# Altium schematic sheet bangtai.SchDoc
size A
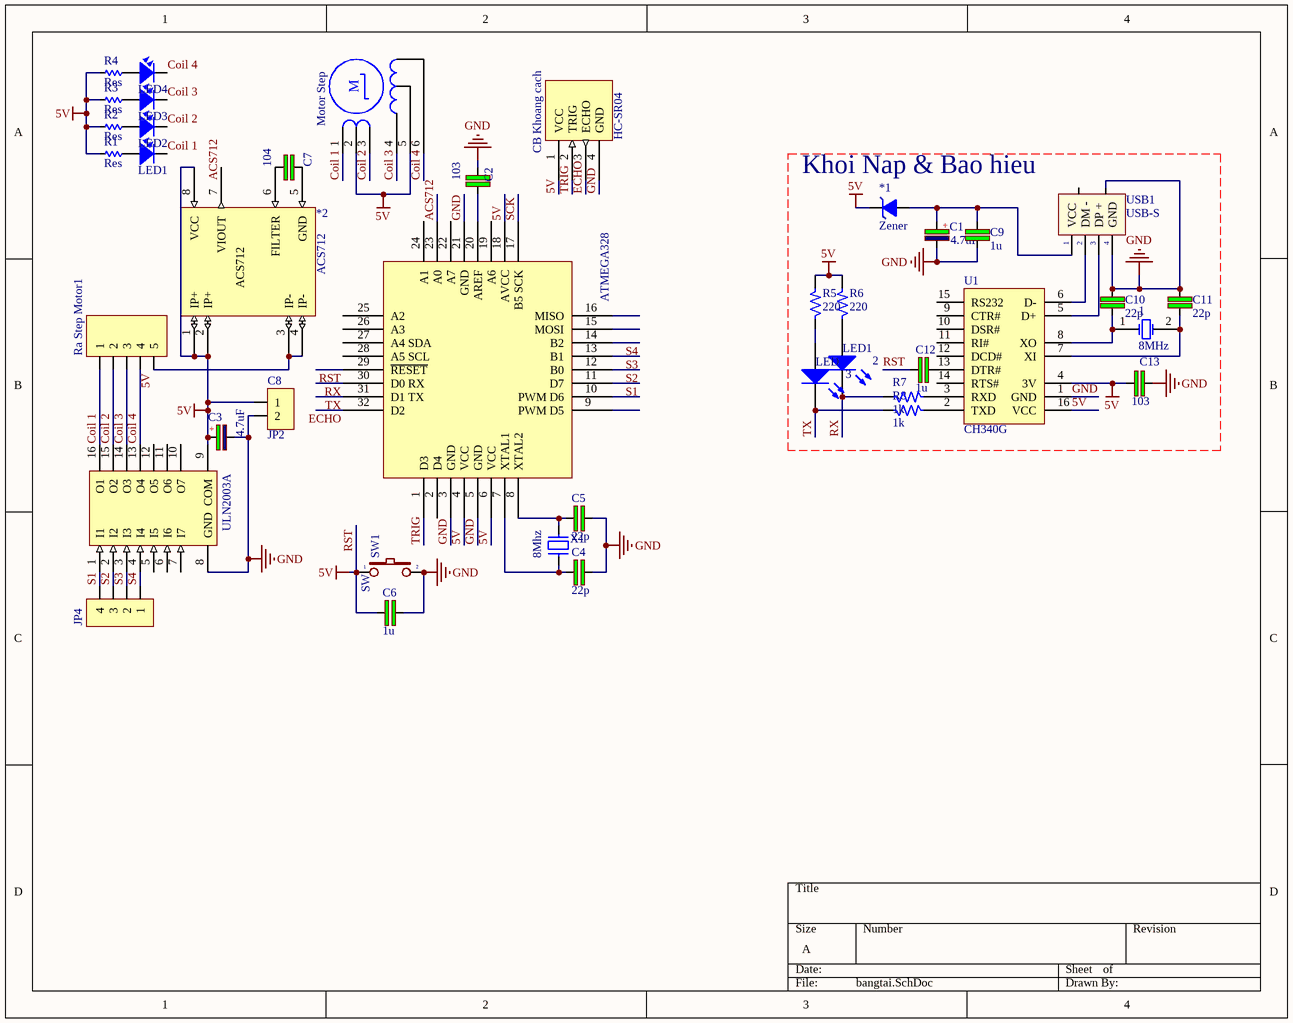
[diagram p0: bangtai.SchDoc]

## Parts
(Parts that share a designator on the sheet are numbered #1, #2 ... from top to bottom, then left to right.)
1  8MHz  [R38]
2  LED1  [3.5X2.8X1.9]
3  LED  [3.5X2.8X1.9]
*1  Zener  [D1A]
*2  ACS712  [SOIC8]
?#1  Motor Step  [HDR6]
?#2  ATMEGA328  [TQFP80P900X900X120-32N]
?#3  ULN2003A  [SO-G16/X.6]
?#4  JP4  [JP4-C1T]
C1  4.7uF  [CP4.5/19]
C2  103  [C-0805]
C3  4.7uF  [10uF/10V]
C4  22p  [C-0805]
C5  22p  [C-0805]
C6  1u  [CN1.5]
C7  104  [CN1.5]
C8  JP2  [JP2-C1T]
C9  1u  [CN3]
C10  22p  [CN3]
C11  22p  [CN3]
C12  1u  [CN3]
C13  103  [CN3]
CB_Khoang_cach  HC-SR04  [HC-SR04]
LED1  LED  [LED-3MM-YELLOW]  (value not drawn)
LED2  LED  [LED-3MM-YELLOW]  (value not drawn)
LED3  LED  [LED-3MM-YELLOW]  (value not drawn)
LED4  LED  [LED-3MM-YELLOW]  (value not drawn)
R1  Res  [RES-1/2W]
R2  Res  [RES-1/2W]
R3  Res  [RES-1/2W]
R4  Res  [RES-1/2W]
R5  220  [SM-1206]
R6  220  [SM-1206]
R7  1k  [SM-1206]
R8  1k  [SM-1206]
Ra_Step_Motor1  (no value)  [JP5-C1T]
SW1  SW  [BUTTON 2PIN TRON]
U1  CH340G  [SO16]
USB1  USB-S  [USB-S1]
X1  8Mhz  [XT2]

## Nets
5V: *1.2(K) *2.1(IP+) *2.2(IP+) *2.8(VCC) ?#1.2 ?#1.5 ?#2.4(VCC) ?#2.6(VCC) ?#2.18(AVCC) ?#2.29(~{RESET}) ?#3.9(COM) C3.1 C6.2 C8.1 C12.2 C13.1 CB_Khoang_cach.1(VCC) R1.1 R2.1 R3.1 R4.1 R5.2 R6.2 SW1.1 U1.4(3V) U1.16(VCC)  [also labelled RST]
GND: ?#2.3(GND) ?#2.5(GND) ?#2.21(GND) ?#3.8(GND) C1.2 C2.1 C3.2 C4.1 C5.1 C6.1 C8.2 C9.1 C10.2 C11.2 C13.2 CB_Khoang_cach.4(GND) SW1.2 U1.1(GND) USB1.4(GND) USB1.6
ACS712: ?#2.23(A0)
Coil 1: ?#1.1(1A) ?#3.16(O1) LED1.2 Ra_Step_Motor1.1
Coil 2: ?#1.3 ?#3.15(O2) LED2.2 Ra_Step_Motor1.2
Coil 3: ?#1.4 ?#3.14(O3) LED3.2 Ra_Step_Motor1.3
Coil 4: ?#1.6 ?#3.13(O4) LED4.2 Ra_Step_Motor1.4
ECHO: ?#2.32(D2) CB_Khoang_cach.3(ECHO)
RX: 2.2(K) ?#2.30(D0_RX) R7.1
S1: ?#2.11(D7) ?#3.1(I1) ?#4.4
S2: ?#2.12(B0) ?#3.2(I2) ?#4.3
S3: ?#2.13(B1) ?#3.3(I3) ?#4.2
S4: ?#2.14(B2) ?#3.4(I4) ?#4.1
SCK: ?#2.17(B5_SCK)
TRIG: ?#2.1(D3) CB_Khoang_cach.2(TRIG)
TX: 3.2(K) ?#2.31(D1_TX) R8.1
Net1_1: 1.1(OSC1) C10.1 U1.8(XO)
Net1_2: 1.2(OSC2) C11.1 U1.7(XI)
Net2_1: 2.1(A) R6.1
Net3_1: 3.1(A) R5.1
Net*1_1: *1.1(A) C1.1 C9.2 USB1.1(VCC)
Net*2_3: *2.3(IP-) *2.4(IP-) Ra_Step_Motor1.5
Net*2_5: *2.5(GND) C7.2
Net*2_6: *2.6(FILTER) C7.1
Net?#2_7: ?#2.7(XTAL1) C4.2 X1.2
Net?#2_8: ?#2.8(XTAL2) C5.2 X1.1
Net?#2_20: ?#2.20(AREF) C2.2
NetC12_1: C12.1 U1.13(DTR#)
NetLED1_1: LED1.1 R1.2
NetLED2_1: LED2.1 R2.2
NetLED3_1: LED3.1 R3.2
NetLED4_1: LED4.1 R4.2
NetR7_2: R7.2 U1.3(RXD)
NetR8_2: R8.2 U1.2(TXD)
NetU1_5: U1.5(D+) USB1.3(DP_+)
NetU1_6: U1.6(D-) USB1.2(DM_-)

Not connected (* = marked no-connect by the designer): *2 7(VIOUT); ?#2 2(D4) 9(PWM_D5) 10(PWM_D6) 15(MOSI) 16(MISO) 19(A6) 22(A7) 24(A1) 25(A2) 26(A3) 27(A4_SDA) 28(A5_SCL); ?#3 5(I5) 6(I6) 7(I7) 10(O7) 11(O6) 12(O5); U1 9(CTR#) 10(DSR#) 11(RI#) 12(DCD#) 14(RTS#) 15(RS232); USB1 5

## Notes on the sheet
- Khoi Nap & Bao hieu
- Labels drawn without touching a wire or pin: 5V, ACS712
- (in symbol CP0_1) +
- (in symbol CP9) +
- (in symbol Motor Step) M

## Library data of the parts
1 = XTAL: Crystal Oscillator; Published: 8-Jun-2000; LatestRevisionDate: 17-Jul-2002; LatestRevisionNote: Re-released for DXP Platform.; PackageReference: R38; Publisher: Altium Limited; PackageDescription: Crystal, Thru-Hole; 2 Leads; Body 3.1 x 8.2 mm (Dia.xH)
2 3 = LED3: Typical BLUE SiC LED; Published: 8-Jun-2000; LatestRevisionDate: 17-Dec-2003; LatestRevisionNote: PCB Footprint replaced.; DatasheetVersion: 16-Apr-2002; PackageVersion: 16-Apr-2002; PackageReference: 3.5X2.8X1.9; Publisher: Altium Limited; PackageDescription: SM LED; 2 C-Bend Leads; Body 3.5 x 2.8 x 1.9 mm, inc leads (LxWxH typ)
*1 = Zener: DIOT ZENER
?#1 = Motor Step: Motor Stepper; Published: 24-Mar-1999; LatestRevisionDate: 17-Jul-2002; LatestRevisionNote: Re-released for DXP Platform.; PackageReference: DIP-6; Publisher: Altium Limited; Code_JEDEC: MO-001-AM
?#2 = ATMEGA328P-AU: Microchip Technology ATMEGA328P-AN, 8bit AVR Microcontroller, 20MHz, 32 kB Flash, 32-Pin TQFP
?#3 = ULN2003A: High-Voltage, High-Current Darlington Array; LatestRevisionNote: Stylized 3D Model Added.; Publisher: Altium Limited; Value: ULN2003A
?#4 = JP4: WR-PHD 2.54 mm Angled Socket Header; Manufacturer: W¨¹rth Elektronik eiSos GmbH; partNo: 613004143121; ComponentLink1 Description: Manufacturer; ComponentLink2 Description: Datasheet; NoPins: 04; Created Date: 29 March 2013; ComponentLink1URL: http://www.we-online.com; ComponentLink2URL: http://katalog.we-online.de/em/datasheet/6130xx143121.pdf; Created by: Karrer Zheng
C1 = CP9: Cap 10000uF/63V; Value: 220uF/450V
C2 = C: Cap SMD; Value: 103
C3 = CP0_1: Cap P  0,1uF < 22uF , 16 - 50V; Value: 10uF/50V; Description 1: 10 => 220uF/6,3V/10V - 10uF => 100uF/16V; Description 2: 0,1uF => 33uF/50V - 10uF => 22uF/63V; Description 3: 0,47uF => 10uF/100V
C4 C5 = C: Cap SMD; Value: 103
C6 C7 = CN1.5: Cap np 682pF => 104pF; Value: 0.01uF
C8 = JP2: WR-PHD 2.54 mm Angled Socket Header; Manufacturer: W¨¹rth Elektronik eiSos GmbH; partNo: 613002143121; ComponentLink1 Description: Manufacturer; ComponentLink2 Description: Datasheet; NoPins: 02; Created Date: 29 March 2013; ComponentLink1URL: http://www.we-online.com; ComponentLink2URL: http://katalog.we-online.de/em/datasheet/6130xx143121.pdf; Created by: Karrer Zheng
C9-C13 = CN3: Cap np W0.3; Value: 0,047uF; Copyright: VanDungEvn
LED1-LED4 = LED: LED Single colour Green and Red; Value: LED 3 ly Single Colour
R1-R4 = Res: Manufacturer: Generic Components; Class: Passive; SubClass: R; Published: 08/06/2000; Publisher: Altium Hobart Technology Centre
R5-R8 = R: Resistor 1/4W; Value: R1/4W - 1K
Ra_Step_Motor1 = JP5: WR-PHD 2.54 mm Angled Socket Header; Manufacturer: W¨¹rth Elektronik eiSos GmbH; partNo: 613005143121; ComponentLink1 Description: Manufacturer; ComponentLink2 Description: Datasheet; NoPins: 05; Created Date: 29 March 2013; ComponentLink1URL: http://www.we-online.com; ComponentLink2URL: http://katalog.we-online.de/em/datasheet/6130xx143121.pdf; Created by: Karrer Zheng
SW1 = SW2: Switch button 2 pin; Value: SW chip 2 pin
U1 = CH340G: High and Low Side Driver; Note: Pins 4, 8 and 14 are not connected; Published: 8-Jun-2000; LatestRevisionDate: 04-Mar-2005; LatestRevisionNote: Stylized 3D Model Added.; DatasheetVersion: PD60147J; PackageReference: PDIP14; Publisher: Altium Limited; PackageDescription: DIP; 14 Leads; Row Spacing 7.62 mm; Pitch 2.54 mm; ComponentLink1Description: Manufacturer Link; ComponentLink1URL: http://www.irf.com/; ComponentLink2Description: Datasheet; ComponentLink2URL: http://www.irf.com/product-info/datasheets/data/ir2110.pdf
USB1 = USB_S: USB connector; Value: USB
X1 = XT2: Crystal For all Crystal 2pin.; Value: 4Mhz
CB_Khoang_cach = HC-SR04: TECHMT.VN: TECHMT.VN